# Altium project ESIMA_EIS.PrjPcb (part 2 of 2)

## Sheet EIS_Main_SensorInterface.SchDoc: Wirless-Power und Sensor-Schnittstellen
size A4; Organization: Hahn-Schickard; Address1: Wilhelm-Schickard-Str. 10; Address2: 78052 Villingen-Schwenningen; Address3: Bernd.Ehrbrecht@Hahn-Schickard.de; DocumentNumber: 1; Revision: 1.0; SheetNumber: 7; SheetTotal: 7; PhoneNumber: 0 7721 943 137; E-Mail: Xxxx.Xxxx@Hahn-Schickard.de; ProjectName: Project File Name
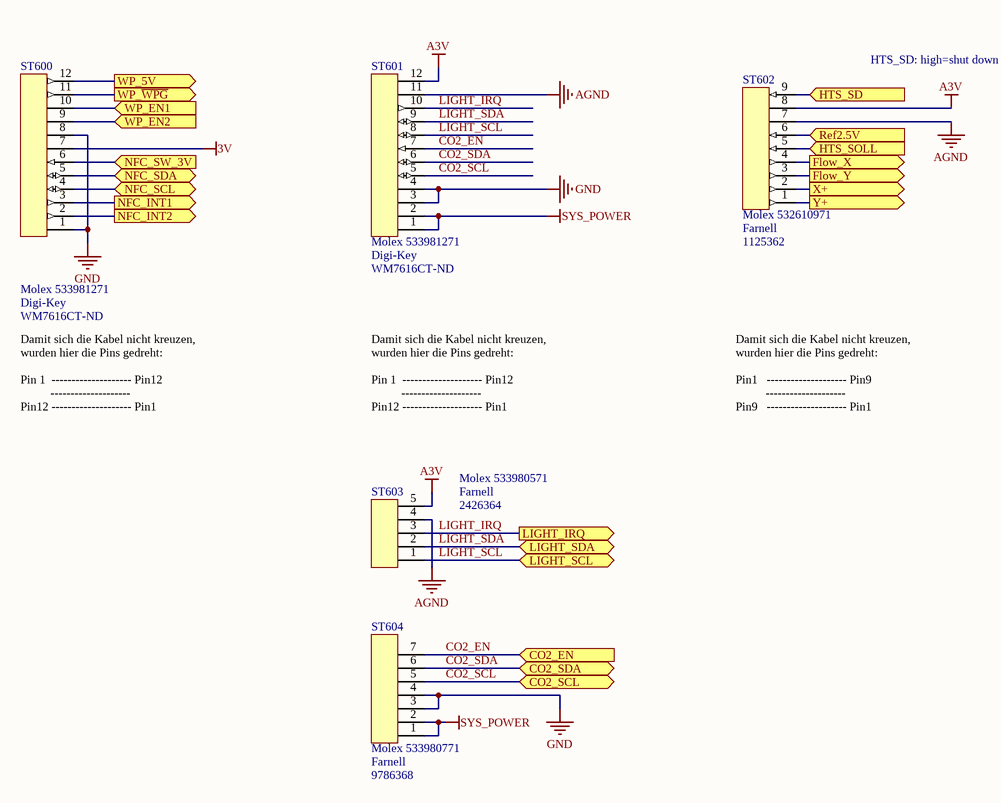
[diagram p5: EIS_Main_SensorInterface.SchDoc]

### Parts
ST600  Molex 533981271  Supplier 1: Digi-Key  Supplier Part Number 1: WM7616CT-ND  [Molex 533981271]
ST601  Molex 533981271  Supplier 1: Digi-Key  Supplier Part Number 1: WM7616CT-ND  [Molex 533981271]
ST602  Molex 532610971  Supplier 1: Farnell  Supplier Part Number 1: 1125362  [Molex 532610971]
ST603  Molex 533980571  Supplier 1: Farnell  Supplier Part Number 1: 2426364  [Molex 533980571]
ST604  Molex 533980771  Supplier 2: Farnell  Supplier Part Number 2: 9786368  [Molex 533980771]

### Ports
CO2_EN (in), CO2_SCL (bidir), CO2_SDA (bidir), Flow_X (out), Flow_Y (out), HTS_SD (in), HTS_SOLL (in), LIGHT_IRQ (out), LIGHT_SCL (bidir), LIGHT_SDA (bidir), NFC_INT1 (out), NFC_INT2 (out), NFC_SCL (bidir), NFC_SDA (bidir), NFC_SW_3V (in), Ref2.5V (in), WP_5V (out), WP_EN1 (in), WP_EN2 (in), WP_~{WPG} (out), X+ (out), Y+ (out)

### Nets
3V: ST600.7
A3V: ST601.12 ST602.8 ST603.5
AGND: ST601.11 ST602.7 ST603.4
GND: ST600.1 ST600.8 ST601.3 ST601.4 ST604.3 ST604.4
Ref2.5V: ST602.6 ; port Ref2.5V
SYS_POWER: ST601.1 ST601.2 ST604.1 ST604.2
USB_5V: ST600.12 ; port WP_5V
CO2_EN: ST601.7 ST604.7 ; port CO2_EN
CO2_SCL: ST601.5 ST604.5 ; port CO2_SCL
CO2_SDA: ST601.6 ST604.6 ; port CO2_SDA
Flow_HTS_DAC: ST602.5 ; port HTS_SOLL
Flow_HTS_SD: ST602.9 ; port HTS_SD
Flow_Temp_Diode: ST602.1 ; port Y+
Flow_TP1: ST602.4 ; port Flow_X
Flow_TP2: ST602.3 ; port Flow_Y
Flow_TPT1: ST602.2 ; port X+
LIGHT_IRQ: ST601.10 ST603.3 ; port LIGHT_IRQ
LIGHT_SCL: ST601.8 ST603.1 ; port LIGHT_SCL
LIGHT_SDA: ST601.9 ST603.2 ; port LIGHT_SDA
UCB1_SCL: ST600.4 ; port NFC_SCL
UCB1_SDA: ST600.5 ; port NFC_SDA
NetR107_1: ST600.11 ; port WP_~{WPG}
NetST600_2: ST600.2 ; port NFC_INT2
NetST600_3: ST600.3 ; port NFC_INT1
NetST600_6: ST600.6 ; port NFC_SW_3V
NetST600_9: ST600.9 ; port WP_EN2
NetST600_10: ST600.10 ; port WP_EN1

Not connected (* = marked no-connect by the designer): ST600 13 14; ST601 13 14; ST603 6 7; ST604 8 9

### Notes on the sheet
- (near ST602) HTS_SD: high=shut down
- Damit sich die Kabel nicht kreuzen, wurden hier die Pins gedreht:
  Pin 1  -------------------- Pin12
  --------------------
  Pin12 -------------------- Pin1
- Damit sich die Kabel nicht kreuzen, wurden hier die Pins gedreht:
  Pin1   -------------------- Pin9
  --------------------
  Pin9   -------------------- Pin1
- Project Name:
- Size:
- Date:
- Title:
- A4
- Time:
- Revision:
- Sheet
- of
- File:

### Library data of the parts
ST600 ST601 = Molex 533981271: Molex Pico 12Pol Blade SMD gerade 533980871; 07_Lieferant: Digi-Key; 08_Lieferanten_Nummer: WM7616CT-ND
ST602 = Molex 532610971: Stecker 9Pol universal; 07_Lieferant: Farnell; 08_Lieferanten_Nummer: 1125362
ST603 = Molex 533980571: MOLEX - 53398-0571 - STIFTLEISTE, SMT, 1.25MM, 5POL; 08_Lieferanten_Nummer: 1125354; 07_Lieferant: Farnell
ST604 = Molex 533980771: Molex Pico 7Pol Blade SMD gerade 533980771; Supplier 1: Farnell; 07_Lieferant: Farnell; 08_Lieferanten_Nummer: 9786368

## Sheet EIS_Main_Power.SchDoc: EIS: Netzteile
size A4; FaxNumber: 07721 / 943 -210; Organization: Hahn-Schickard; Address1: Wilhelm-Schickard-Str. 10; Address2: 78052 Villingen-Schwenningen; Address3: Bernd.Ehrbrecht@Hahn-Schickard.de; DocumentNumber: 1; Revision: 1.0; SheetNumber: 3; SheetTotal: 7; PhoneNumber: 0 7721 943 137; E-Mail: Xxxx.Xxxx@Hahn-Schickard.de; ProjectName: Project File Name
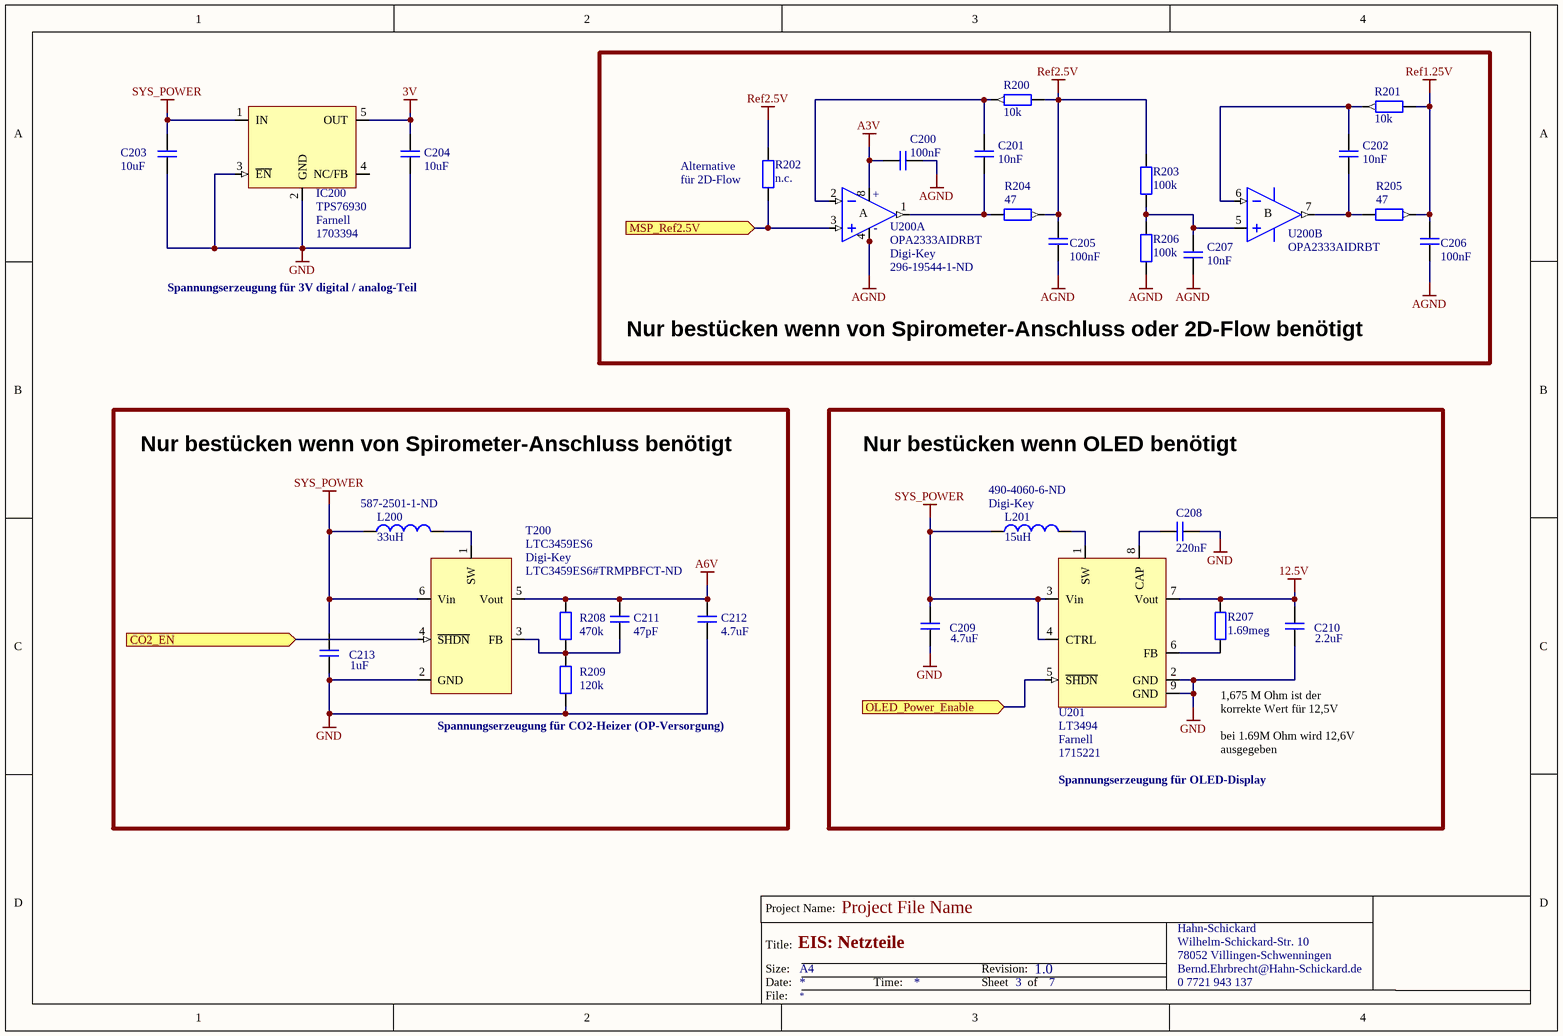
[diagram p6: EIS_Main_Power.SchDoc]

### Parts
C200  100nF  [CAPC1608N]
C201  10nF  [CAPC1608N]
C202  10nF  [CAPC1608N]
C203  10uF  [CAPC1608N]
C204  10uF  [CAPC1608N]
C205  100nF  [CAPC1608N]
C206  100nF  [CAPC1608N]
C207  10nF  [CAPC1608N]
C208  220nF  [CAPC1608N]
C209  4.7uF  [CAPC1608N]
C210  2.2uF  [CAPC1608N]
C211  47pF  [CAPC1608N]
C212  4.7uF  [CAPC1608N]
C213  1uF  [CAPC1608N]
IC200  TPS76930  Supplier 1: Farnell  Supplier Part Number 1: 1703394  [TI-DBV5 (SOT23-5)]
L200  value 33uH  Supplier Part Number 1: 587-2501-1-ND  [RESC2012N]  (hidden comment: Inductor)
L201  Supplier 1: Digi-Key  Supplier Part Number 1: 490-4060-6-ND  [INDC3225N]  (hidden comment: 15uH)
R200  10k  [RESC1608N]
R201  10k  [RESC1608N]
R202  n.c.  [RESC1608N]
R203  100k  [RESC1608N]
R204  47  [RESC1608N]
R205  47  [RESC1608N]
R206  100k  [RESC1608N]
R207  1.69meg  [RESC1608N]
R208  470k  [RESC1608N]
R209  120k  [RESC1608N]
T200  LTC3459ES6  Supplier 1: Digi-Key  Supplier Part Number 1: LTC3459ES6#TRMPBFCT-ND  [TSOT23 - 6]
U200  OPA2333AIDRBT  Supplier 1: Digi-Key  Supplier Part Number 1: 296-19544-1-ND  [TI DRB (S-PVON-N8)]  (parts A,B of 2)
U201  LT3494  Supplier 1: Farnell  Supplier Part Number 1: 1715221  [DFN-DDB-8]

### Blocks framed on the sheet
Spannungserzeugung für CO2-Heizer (OP-Versorgung): C211-C213 L200 R208 R209 T200
Spannungserzeugung für OLED-Display: C208-C210 L201 R207 U201

### Ports
CO2_EN (in), MSP_Ref2.5V (in), OLED_Power_Enable (in)

### Nets
3V: C204.2 IC200.5(OUT)
12.5V: C210.2 R207.2 U201.7(Vout)
A3V: C200.1 U200.8(V+)
A6V: C211.2 C212.2 R208.2 T200.5(Vout)
AGND: C200.2 C205.1 C206.1 C207.1 R206.1 U200.4(V-) U200.9(tp1)
GND: C203.1 C204.1 C208.1 C209.1 C210.1 C212.1 C213.1 IC200.2(GND) IC200.3(~{EN}) R209.1 T200.2(GND) U201.2(GND) U201.9(GND)
Ref1.25V: C206.2 R201.1 R205.2
Ref2.5V: C205.2 R200.1 R202.2 R203.2 R204.2
SYS_POWER: C203.2 C209.2 C213.2 IC200.1(IN) L200.1 L201.1 T200.6(Vin) U201.3(Vin) U201.4(CTRL)
CO2_EN: T200.4(~{SHDN}) ; port CO2_EN
NetC103_1: R202.1 U200.3(IN1+) ; port MSP_Ref2.5V
NetC201_1: C201.1 R204.1 U200.1(OUT1)
NetC201_2: C201.2 R200.2 U200.2(IN1-)
NetC202_1: C202.1 R205.1 U200.7(OUT1)
NetC202_2: C202.2 R201.2 U200.6(IN1-)
NetC207_2: C207.2 R203.1 R206.2 U200.5(IN1+)
NetC208_2: C208.2 U201.8(CAP)
NetC211_1: C211.1 R208.1 R209.2 T200.3(FB)
NetL200_2: L200.2 T200.1(SW)
NetL201_2: L201.2 U201.1(SW)
NetR207_1: R207.1 U201.6(FB)
NetU100_52: U201.5(~{SHDN}) ; port OLED_Power_Enable

Not connected (* = marked no-connect by the designer): IC200 4(NC/FB)

### Notes on the sheet
- (near R202) Alternative
- (near R202) für 2D-Flow
- Spannungserzeugung für 3V digital / analog-Teil
- Nur bestücken wenn von Spirometer-Anschluss oder 2D-Flow benötigt
- Nur bestücken wenn von Spirometer-Anschluss benötigt
- Nur bestücken wenn OLED benötigt
- 1,675 M Ohm ist der korrekte Wert für 12,5V
  bei 1.69M Ohm wird 12,6V ausgegeben
- Project Name:
- Size:
- Date:
- Title:
- A4
- Time:
- Revision:
- Sheet
- of
- File:
- (in symbol OPA2333AIDRBT, part A) +; A; -
- (in symbol OPA2333AIDRBT, part B) B

### Library data of the parts
C200 C205 C206 = Kondensator SMD Keramik: 07_Lieferant: Digi-Key; 08_Lieferanten_Nummer: 399-1096-1-ND
C201 C202 C207 = Kondensator SMD Keramik: 07_Lieferant: Digi-Key; 08_Lieferanten_Nummer: 399-1091-1-ND
C203 C204 = Kondensator SMD Keramik: 07_Lieferant: Digi-Key; 08_Lieferanten_Nummer: 490-7201-1-ND
C208 = Kondensator SMD Keramik: 07_Lieferant: Digi-Key; 08_Lieferanten_Nummer: 445-1318-1-ND
C209 C212 = Kondensator SMD Keramik: 07_Lieferant: Digi-Key; 08_Lieferanten_Nummer: 1276-2087-1-ND
C210 = Kondensator SMD Keramik: 07_Lieferant: Digi-Key; 08_Lieferanten_Nummer: 587-3386-1-ND
C211 = Kondensator SMD Keramik: 07_Lieferant: Digi-Key; 08_Lieferanten_Nummer: 1276-1037-1-ND
C213 = Kondensator SMD Keramik: 07_Lieferant: Digi-Key; 08_Lieferanten_Nummer: 1276-1946-1-ND
IC200 = TPS76930: Low Output, Adjustable, Ultralow-Power, 100-mA Low Dropout Linear Regulator; Package Document: O:\Altium Designer\Datasheets\Texas Instruments\TPS76201; ComponentLink1Description: Texas Instruments; ComponentLink1URL: http://www.ti.com/; ComponentLink2Description: Datasheet; ComponentLink2URL: http://www.ti.com/; DatasheetDokument: O:\Altium Designer\Datasheets\Texas Instruments\TPS76201; Published: 20-09-2011; Publisher: HSG Selvakumar Palanichamy; Supplier: Farnell; Supplier Ordering Number: 1706314; 07_Lieferant: Farnell; 08_Lieferanten_Nummer: 1703394
L200 = Inductor: Code_IEC: 1005; 07_Lieferant: Digi-Key; Published: 8-Jun-2000; LatestRevisionDate: 29-May-2009; LatestRevisionNote: IPC-7351 Footprint Added.; PackageReference: 0402-A; Publisher: Altium Limited; PackageDescription: Chip Inductor; Code_JEITA: 0402; Supplier 1: Digi-Key; 08_Lieferanten_Nummer: 587-2501-1-ND
L201 = Inductor: Code_IEC: 1005; Published: 8-Jun-2000; LatestRevisionDate: 29-May-2009; LatestRevisionNote: IPC-7351 Footprint Added.; PackageReference: 0402-A; Publisher: Altium Limited; PackageDescription: Chip Inductor; Code_JEITA: 0402; Value: 15uH; 07_Lieferant: Digi-Key; 08_Lieferanten_Nummer: 490-4060-6-ND
R200 R201 = Widerstand SMD: Value: 0; 07_Lieferant: Digi-Key; 08_Lieferanten_Nummer: 311-10KGRCT-ND
R202 = Widerstand SMD: Value: n.c.
R203 R206 = Widerstand SMD: 07_Lieferant: Digi-Key; 08_Lieferanten_Nummer: 311-100KGRCT-ND; Value: 100k
R204 R205 = Widerstand SMD: 07_Lieferant: Digi-Key; 08_Lieferanten_Nummer: 311-47GRCT-ND; Value: 47
R207 = Widerstand SMD: 07_Lieferant: Digi-Key; 08_Lieferanten_Nummer: 1276-4940-1-ND
R208 = Widerstand SMD: 07_Lieferant: Digi-Key; 08_Lieferanten_Nummer: 311-470KGRCT-ND
R209 = Widerstand SMD: 07_Lieferant: Digi-Key; 08_Lieferanten_Nummer: 311-120KGRCT-ND; Value: 120k
T200 = Spannung Wandler - LTC3459ES6: 07_Lieferant: Digi-Key; 08_Lieferanten_Nummer: LTC3459ES6#TRMPBFCT-ND
U200 = OPA2333AIDRBT: Dual micro Power OP; 01_Hersteller: Texas Instruments; 05_Datasheet_Link_Lokal: O:\Altium Designer\Datasheets\Texas Instruments\OPA333; 09_Ersteller: HSG Jürgen Merz; 02_Herstellerbezeichnung: ka; 03_Hersteller_Link: http://www.ti.com; 04_Datasheet_Link: Datasheet; 06 Footprint_Link_Lokal: O:\Altium Designer\Datasheets\Texas Instruments\OPA333; 10_Erstell_Datum: 12.10.2010; 07_Lieferant: Digi-Key; 08_Lieferanten_Nummer: 296-19544-1-ND
U201 = LT3494: Bost-Konverter; 07_Lieferant: Farnell; 08_Lieferanten_Nummer: 1715221

## Nets that join several sheets
3V: EIS_Main_Akku (R300.2 R301.2 R303.2), EIS_Main_Radio (IC400.P2_7 IC400.P2_9), EIS_Main_Interface (6 pins), EIS_Main_MSP430F6638 (13 pins), EIS_Main_SensorInterface (ST600.7), EIS_Main_Power (C204.2 IC200.5)
12.5V: EIS_Main_Interface (C503.1 C504.1 U500.2), EIS_Main_Power (C210.2 R207.2 U201.7)
A3V: EIS_Main_Interface (P500.12), EIS_Main_MSP430F6638 (6 pins), EIS_Main_SensorInterface (ST601.12 ST602.8 ST603.5), EIS_Main_Power (C200.1 U200.8)
A6V: EIS_Main_Interface (P500.18), EIS_Main_Power (C211.2 C212.2 R208.2 T200.5)
AGND: EIS_Main_Interface (P500.11 P500.17), EIS_Main_MSP430F6638 (11 pins), EIS_Main_SensorInterface (ST601.11 ST602.7 ST603.4), EIS_Main_Power (7 pins)
AKKU+: EIS_Main_Akku (5 pins), EIS_Main_Interface (P501.18)
GND: EIS_Main (5 pins), EIS_Main_Akku (11 pins), EIS_Main_Radio (IC400.P1_1 IC400.P1_19 IC400.P2_2), EIS_Main_Interface (19 pins), EIS_Main_MSP430F6638 (31 pins), EIS_Main_SensorInterface (6 pins), EIS_Main_Power (13 pins)
Ref1.25V: EIS_Main_Interface (P500.10), EIS_Main_Power (C206.2 R201.1 R205.2)
Ref2.5V: EIS_Main_Interface (P500.8), EIS_Main_MSP430F6638 (U102.7), EIS_Main_SensorInterface (ST602.6), EIS_Main_Power (5 pins)
SYS_POWER: EIS_Main_Akku (S300.1), EIS_Main_SensorInterface (ST601.1 ST601.2 ST604.1 ST604.2), EIS_Main_Power (9 pins)
USB_5V: EIS_Main_Akku (C302.2 J300.1 U302.4 U302.9), EIS_Main_Interface (C507.1 IC500.5 P501.12 S500.1), EIS_Main_MSP430F6638 (C114.1 C115.1 R109.1 U100.80), EIS_Main_SensorInterface (ST600.12)
CO2_EN: EIS_Main_MSP430F6638 (U100.75), EIS_Main_SensorInterface (ST601.7 ST604.7), EIS_Main_Power (T200.4)
CO2_SCL: EIS_Main_MSP430F6638 (U100.74), EIS_Main_SensorInterface (ST601.5 ST604.5)
CO2_SDA: EIS_Main_MSP430F6638 (U100.73), EIS_Main_SensorInterface (ST601.6 ST604.6)
Flow_HTS_DAC: EIS_Main_Interface (P500.9), EIS_Main_MSP430F6638 (U100.4), EIS_Main_SensorInterface (ST602.5)
Flow_HTS_SD: EIS_Main_Interface (P501.2), EIS_Main_MSP430F6638 (U100.35), EIS_Main_SensorInterface (ST602.9)
Flow_Temp_Diode: EIS_Main_Interface (P500.4), EIS_Main_MSP430F6638 (U100.100), EIS_Main_SensorInterface (ST602.1)
Flow_TP1: EIS_Main_Interface (P500.1), EIS_Main_MSP430F6638 (U100.97), EIS_Main_SensorInterface (ST602.4)
Flow_TP2: EIS_Main_Interface (P500.2), EIS_Main_MSP430F6638 (U100.98), EIS_Main_SensorInterface (ST602.3)
Flow_TPT1: EIS_Main_Interface (P500.3), EIS_Main_MSP430F6638 (U100.99), EIS_Main_SensorInterface (ST602.2)
LIGHT_IRQ: EIS_Main_MSP430F6638 (U100.56), EIS_Main_SensorInterface (ST601.10 ST603.3)
LIGHT_SCL: EIS_Main_Akku (IC300.4 R300.1), EIS_Main_Interface (P501.9), EIS_Main_MSP430F6638 (U100.23), EIS_Main_SensorInterface (ST601.8 ST603.1)
LIGHT_SDA: EIS_Main_Akku (IC300.5 R301.1), EIS_Main_Interface (P501.10), EIS_Main_MSP430F6638 (U100.24), EIS_Main_SensorInterface (ST601.9 ST603.2)
NetC103_1: EIS_Main_MSP430F6638 (C103.1 C104.1 U100.9), EIS_Main_Power (R202.1 U200.3)
NetJ300_2: EIS_Main_Akku (J300.2 R316.2), EIS_Main_MSP430F6638 (U100.67)
NetP500_5: EIS_Main_Interface (P500.5), EIS_Main_MSP430F6638 (U100.2)
NetP500_6: EIS_Main_Interface (P500.6), EIS_Main_MSP430F6638 (U100.3)
NetP500_7: EIS_Main_Interface (P500.7), EIS_Main_MSP430F6638 (U100.1)
NetP500_13: EIS_Main_Interface (P500.13), EIS_Main_MSP430F6638 (U102.2)
NetP500_14: EIS_Main_Interface (P500.14), EIS_Main_MSP430F6638 (U102.3)
NetP500_15: EIS_Main_Interface (P500.15), EIS_Main_MSP430F6638 (U102.4)
NetP500_16: EIS_Main_Interface (P500.16), EIS_Main_MSP430F6638 (U102.5)
NetP501_1: EIS_Main_Interface (P501.1), EIS_Main_MSP430F6638 (U100.17)
NetP501_3: EIS_Main_Interface (P501.3), EIS_Main_MSP430F6638 (U100.36)
NetP501_4: EIS_Main_Interface (P501.4), EIS_Main_MSP430F6638 (U100.20)
NetP501_5: EIS_Main_Interface (P501.5), EIS_Main_MSP430F6638 (U100.18)
NetP501_6: EIS_Main_Interface (P501.6), EIS_Main_MSP430F6638 (U100.19)
NetP501_7: EIS_Main_Interface (P501.7), EIS_Main_MSP430F6638 (U100.21)
NetP501_8: EIS_Main_Interface (P501.8), EIS_Main_MSP430F6638 (U100.22)
NetR107_1: EIS_Main_MSP430F6638 (R107.1 R109.2), EIS_Main_SensorInterface (ST600.11)
NetR305_2: EIS_Main_Akku (R305.2 U302.8), EIS_Main_MSP430F6638 (U100.37)
NetR306_2: EIS_Main_Akku (R306.2 U302.7), EIS_Main_MSP430F6638 (U100.34)
NetR310_1: EIS_Main_Akku (R310.1 R311.1 R312.1), EIS_Main_MSP430F6638 (U100.38)
NetR310_2: EIS_Main_Akku (R310.2 U302.18), EIS_Main_MSP430F6638 (U100.39)
NetR311_2: EIS_Main_Akku (R311.2 U302.3), EIS_Main_MSP430F6638 (U100.40)
NetR312_2: EIS_Main_Akku (R312.2 U302.2), EIS_Main_MSP430F6638 (U100.41)
NetR316_1: EIS_Main_Akku (R316.1), EIS_Main_MSP430F6638 (U100.61)
NetST600_2: EIS_Main_MSP430F6638 (U100.55), EIS_Main_SensorInterface (ST600.2)
NetST600_3: EIS_Main_MSP430F6638 (U100.54), EIS_Main_SensorInterface (ST600.3)
NetST600_6: EIS_Main_MSP430F6638 (U100.62), EIS_Main_SensorInterface (ST600.6)
NetU100_5: EIS_Main_Interface (U500.16), EIS_Main_MSP430F6638 (U100.5)
NetU100_6: EIS_Main_Interface (U500.15), EIS_Main_MSP430F6638 (U100.6)
NetU100_7: EIS_Main_Interface (U500.14), EIS_Main_MSP430F6638 (U100.7)
NetU100_8: EIS_Main_Interface (U500.13), EIS_Main_MSP430F6638 (U100.8)
NetU100_52: EIS_Main_MSP430F6638 (U100.52), EIS_Main_Power (U201.5)
NetU100_53: EIS_Main_Interface (U500.17), EIS_Main_MSP430F6638 (U100.53)
OLED_D0: EIS_Main_Interface (U500.12), EIS_Main_MSP430F6638 (U100.42)
OLED_D1: EIS_Main_Interface (U500.11), EIS_Main_MSP430F6638 (U100.43)
OLED_D2: EIS_Main_Interface (U500.10), EIS_Main_MSP430F6638 (U100.44)
OLED_D3: EIS_Main_Interface (U500.9), EIS_Main_MSP430F6638 (U100.45)
OLED_D4: EIS_Main_Interface (U500.8), EIS_Main_MSP430F6638 (U100.46)
OLED_D5: EIS_Main_Interface (U500.7), EIS_Main_MSP430F6638 (U100.47)
OLED_D6: EIS_Main_Interface (U500.6), EIS_Main_MSP430F6638 (U100.48)
OLED_D7: EIS_Main_Interface (U500.5), EIS_Main_MSP430F6638 (U100.49)
RF.CS: EIS_Main_Radio (R403.2), EIS_Main_MSP430F6638 (U100.68)
RF.DataReady: EIS_Main_Radio (R402.2), EIS_Main_MSP430F6638 (U100.57)
RF.MISO: EIS_Main_Radio (R404.2), EIS_Main_MSP430F6638 (U100.71)
RF.MOSI: EIS_Main_Radio (R405.2), EIS_Main_MSP430F6638 (U100.70)
RF.OnOff: EIS_Main_Radio (R401.2), EIS_Main_MSP430F6638 (U100.31)
RF.Reset: EIS_Main_Radio (R400.2), EIS_Main_MSP430F6638 (U100.28)
RF.SCLK: EIS_Main_Radio (R406.2), EIS_Main_MSP430F6638 (U100.69)
UCB1_SCL: EIS_Main_MSP430F6638 (U100.66), EIS_Main_SensorInterface (ST600.4)
UCB1_SDA: EIS_Main_MSP430F6638 (U100.65), EIS_Main_SensorInterface (ST600.5)
USB_DM: EIS_Main_Interface (C505.1 P501.13 R501.2), EIS_Main_MSP430F6638 (U100.79)
USB_DP: EIS_Main_Interface (C506.1 P501.14 R502.2), EIS_Main_MSP430F6638 (R102.1 R104.2 U100.77)